# Altium schematic sheet 05_LMS7002M_Misc.SchDoc: LMS7002M misc
size A3; Organization: Lime Microsystems; Address1: Surrey Tech Centre; Address2: Guildford GU2 7YG; Address3: Surrey; Address4: United Kingdom; Revision: v2.2; SheetNumber: 5; SheetTotal: 10
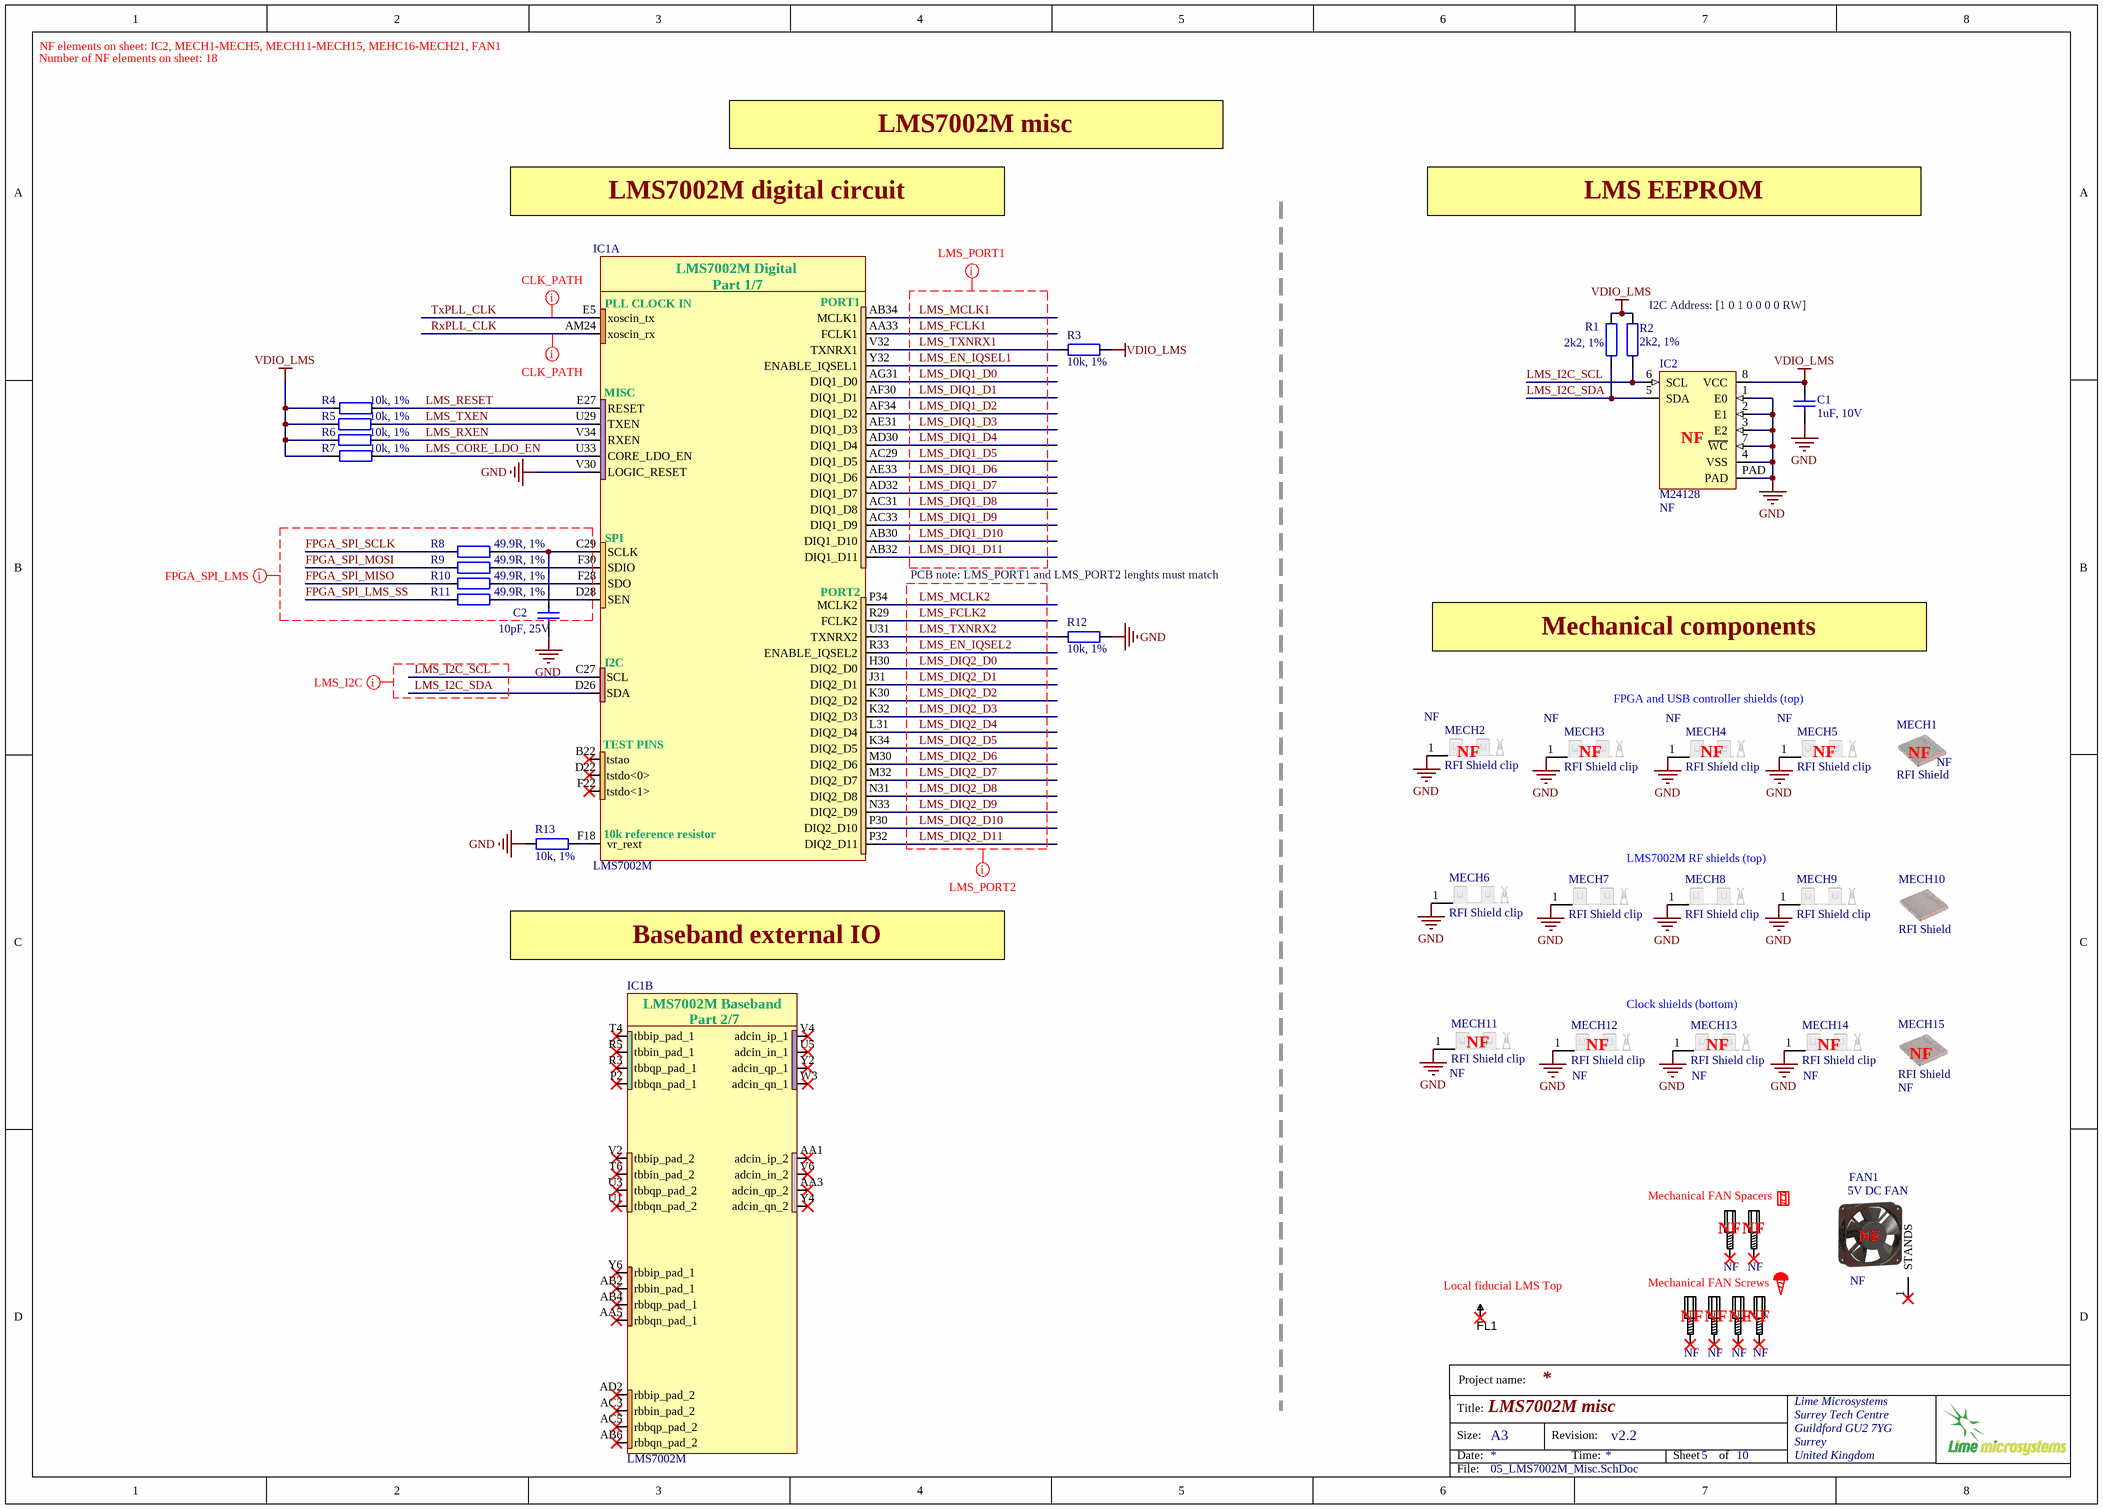
[diagram p0: 05_LMS7002M_Misc.SchDoc]

## Parts
C1  1uF, 10V  [CAP0402]
C2  10pF, 25V  [CAP0402]
FAN1  5V DC FAN  Assembly Info: NF  (mechanical)
FL1  Fiducial  [Fiducial_local]  (value not drawn)
IC1  LMS7002M  [LMS7002M_v5]  (parts A,B of 7)
IC2  M24128  Assembly Info: NF  [M24128-DFMC6TG]
MECH1  RFI Shield  Assembly Info: NF  [WurthElectronic_RF_shield]
MECH2  RFI Shield clip  Assembly Info: NF  [RFI_SHIELD_CLPS_MINI]
MECH3  RFI Shield clip  Assembly Info: NF  [RFI_SHIELD_CLPS_MINI]
MECH4  RFI Shield clip  Assembly Info: NF  [RFI_SHIELD_CLPS_MINI]
MECH5  RFI Shield clip  Assembly Info: NF  [RFI_SHIELD_CLPS_MINI]
MECH6  RFI Shield clip  [RFI_SHIELD_CLPS_MINI]
MECH7  RFI Shield clip  [RFI_SHIELD_CLPS_MINI]
MECH8  RFI Shield clip  [RFI_SHIELD_CLPS_MINI]
MECH9  RFI Shield clip  [RFI_SHIELD_CLPS_MINI]
MECH10  RFI Shield  [WurthElectronic_RF_shield]
MECH11  RFI Shield clip  Assembly Info: NF  [RFI_SHIELD_CLPS_MINI]
MECH12  RFI Shield clip  Assembly Info: NF  [RFI_SHIELD_CLPS_MINI]
MECH13  RFI Shield clip  Assembly Info: NF  [RFI_SHIELD_CLPS_MINI]
MECH14  RFI Shield clip  Assembly Info: NF  [RFI_SHIELD_CLPS_MINI]
MECH15  RFI Shield  Assembly Info: NF  [WurthElectronic_RF_shield]
MECH16  Assembly Info: NF  (hidden comment: Spacer M3)  (mechanical)
MECH17  Assembly Info: NF  (hidden comment: Spacer M3)  (mechanical)
MECH18  Assembly Info: NF  (hidden comment: Screws M3 v1)  (mechanical)
MECH19  Assembly Info: NF  (hidden comment: Screws M3 v1)  (mechanical)
MECH20  Assembly Info: NF  (hidden comment: Screws M3 v2)  (mechanical)
MECH21  Assembly Info: NF  (hidden comment: Screws M3 v2)  (mechanical)
R1  2k2, 1%  [RES0402]
R2  2k2, 1%  [RES0402]
R3  10k, 1%  [RES0402]
R4  10k, 1%  [RES0402]
R5  10k, 1%  [RES0402]
R6  10k, 1%  [RES0402]
R7  10k, 1%  [RES0402]
R8  49.9R, 1%  [RES0402]
R9  49.9R, 1%  [RES0402]
R10  49.9R, 1%  [RES0402]
R11  49.9R, 1%  [RES0402]
R12  10k, 1%  [RES0402]
R13  10k, 1%  [RES0402]

## Nets
GND: C1.2 C2.2 IC1.V30(LOGIC_RESET) IC2.1(E0) IC2.2(E1) IC2.3(E2) IC2.4(VSS) IC2.7(~{WC}) IC2.PAD MECH2.1(GND) MECH3.1(GND) MECH4.1(GND) MECH5.1(GND) MECH6.1(GND) MECH7.1(GND) MECH8.1(GND) MECH9.1(GND) MECH11.1(GND) MECH12.1(GND) MECH13.1(GND) MECH14.1(GND) R12.2 R13.2
VDIO_LMS: C1.1 IC2.8(VCC) R1.1 R2.1 R3.2 R4.2 R5.1 R6.1 R7.2
FPGA_SPI_LMS_SS: R11.2
FPGA_SPI_MISO: R10.2
FPGA_SPI_MOSI: R9.2
FPGA_SPI_SCLK: R8.2
LMS_CORE_LDO_EN: IC1.U33(CORE_LDO_EN) R7.1
LMS_DIQ1_D0: IC1.AG31(DIQ1_D0)
LMS_DIQ1_D1: IC1.AF30(DIQ1_D1)
LMS_DIQ1_D2: IC1.AF34(DIQ1_D2)
LMS_DIQ1_D3: IC1.AE31(DIQ1_D3)
LMS_DIQ1_D4: IC1.AD30(DIQ1_D4)
LMS_DIQ1_D5: IC1.AC29(DIQ1_D5)
LMS_DIQ1_D6: IC1.AE33(DIQ1_D6)
LMS_DIQ1_D7: IC1.AD32(DIQ1_D7)
LMS_DIQ1_D8: IC1.AC31(DIQ1_D8)
LMS_DIQ1_D9: IC1.AC33(DIQ1_D9)
LMS_DIQ1_D10: IC1.AB30(DIQ1_D10)
LMS_DIQ1_D11: IC1.AB32(DIQ1_D11)
LMS_DIQ2_D0: IC1.H30(DIQ2_D0)
LMS_DIQ2_D1: IC1.J31(DIQ2_D1)
LMS_DIQ2_D2: IC1.K30(DIQ2_D2)
LMS_DIQ2_D3: IC1.K32(DIQ2_D3)
LMS_DIQ2_D4: IC1.L31(DIQ2_D4)
LMS_DIQ2_D5: IC1.K34(DIQ2_D5)
LMS_DIQ2_D6: IC1.M30(DIQ2_D6)
LMS_DIQ2_D7: IC1.M32(DIQ2_D7)
LMS_DIQ2_D8: IC1.N31(DIQ2_D8)
LMS_DIQ2_D9: IC1.N33(DIQ2_D9)
LMS_DIQ2_D10: IC1.P30(DIQ2_D10)
LMS_DIQ2_D11: IC1.P32(DIQ2_D11)
LMS_EN_IQSEL1: IC1.Y32(ENABLE_IQSEL1)
LMS_EN_IQSEL2: IC1.R33(ENABLE_IQSEL2)
LMS_FCLK1: IC1.AA33(FCLK1)
LMS_FCLK2: IC1.R29(FCLK2)
LMS_I2C_SCL: IC1.C27(SCL) IC2.6(SCL) R2.2
LMS_I2C_SDA: IC1.D26(SDA) IC2.5(SDA) R1.2
LMS_MCLK1: IC1.AB34(MCLK1)
LMS_MCLK2: IC1.P34(MCLK2)
LMS_RESET: IC1.E27(RESET) R4.1
LMS_RXEN: IC1.V34(RXEN) R6.2
LMS_TXEN: IC1.U29(TXEN) R5.2
LMS_TXNRX1: IC1.V32(TXNRX1) R3.1
LMS_TXNRX2: IC1.U31(TXNRX2) R12.1
RxPLL_CLK: IC1.AM24(xoscin_rx)
TxPLL_CLK: IC1.E5(xoscin_tx)
NetC2_1: C2.1 IC1.C29(SCLK) R8.1
NetIC1_D28: IC1.D28(SEN) R11.1
NetIC1_F18: IC1.F18(vr_rext) R13.1
NetIC1_F28: IC1.F28(SDO) R10.1
NetIC1_F30: IC1.F30(SDIO) R9.1

Not connected (* = marked no-connect by the designer): FAN1 1(STANDS)*; FL1 1*; IC1 AA1(adcin_ip_2)* AA3(adcin_qp_2)* AA5(rbbqn_pad_1)* AB2(rbbin_pad_1)* AB4(rbbqp_pad_1)* AB6(rbbqn_pad_2)* AC3(rbbin_pad_2)* AC5(rbbqp_pad_2)* AD2(rbbip_pad_2)* B22(tstao)* D22(tstdo<0>)* F22(tstdo<1>)* P2(tbbqn_pad_1)* R3(tbbqp_pad_1)* R5(tbbin_pad_1)* T4(tbbip_pad_1)* T6(tbbin_pad_2)* U1(tbbqn_pad_2)* U3(tbbqp_pad_2)* U5(adcin_in_1)* V2(tbbip_pad_2)* V4(adcin_ip_1)* V6(adcin_in_2)* W3(adcin_qn_1)* Y2(adcin_qp_1)* Y4(adcin_qn_2)* Y6(rbbip_pad_1)*; MECH16 MH1*; MECH17 MH1*; MECH18 MH1*; MECH19 MH1*; MECH20 MH1*; MECH21 MH1*

## Layout directives
net class CLK_PATH: RxPLL_CLK, TxPLL_CLK
net class FPGA_SPI_LMS: FPGA_SPI_LMS_SS, FPGA_SPI_MISO, FPGA_SPI_MOSI, FPGA_SPI_SCLK
net class LMS_I2C: LMS_I2C_SCL, LMS_I2C_SDA
net class LMS_PORT1: LMS_DIQ1_D0, LMS_DIQ1_D1, LMS_DIQ1_D2, LMS_DIQ1_D3, LMS_DIQ1_D4, LMS_DIQ1_D5, LMS_DIQ1_D6, LMS_DIQ1_D7, LMS_DIQ1_D8, LMS_DIQ1_D9, LMS_DIQ1_D10, LMS_DIQ1_D11, LMS_EN_IQSEL1, LMS_FCLK1, LMS_MCLK1, LMS_TXNRX1
net class LMS_PORT2: LMS_DIQ2_D0, LMS_DIQ2_D1, LMS_DIQ2_D2, LMS_DIQ2_D3, LMS_DIQ2_D4, LMS_DIQ2_D5, LMS_DIQ2_D6, LMS_DIQ2_D7, LMS_DIQ2_D8, LMS_DIQ2_D9, LMS_DIQ2_D10, LMS_DIQ2_D11, LMS_EN_IQSEL2, LMS_FCLK2, LMS_MCLK2, LMS_TXNRX2

## Notes on the sheet
- Number of NF elements on sheet: 18
- NF elements on sheet: IC2, MECH1-MECH5, MECH11-MECH15, MEHC16-MECH21, FAN1
- LMS7002M misc
- LMS7002M digital circuit
- LMS EEPROM
- (near R2) I2C Address: [1 0 1 0 0 0 0 RW]
- (near IC2) NF
- PCB note: LMS_PORT1 and LMS_PORT2 lenghts must match
- Mechanical components
- FPGA and USB controller shields (top)
- (near MECH2) NF
- (near MECH3) NF
- (near MECH4) NF
- (near MECH5) NF
- (near MECH1) NF
- LMS7002M RF shields (top)
- Baseband external IO
- (near MECH11) NF
- (near MECH12) NF
- Clock shields (bottom)
- (near MECH13) NF
- (near MECH14) NF
- (near MECH15) NF
- Mechanical FAN Spacers
- NF
- (near FAN1) NF
- (near FL1) Local fiducial LMS Top
- Mechanical FAN Screws
- Project name:
- Title:
- Size:
- Date:
- A3
- Revision:
- Time:
- Sheet
- of
- File:
- (in symbol LMS7002Mr4, part A) LMS7002M Digital; Part 1/7; PORT1; PLL CLOCK IN; MISC; SPI; PORT2; I2C; TEST PINS; 10k reference resistor
- (in symbol LMS7002Mr4, part B) LMS7002M Baseband; Part 2/7

## Library data of the parts
C1 = Cap_0402: Manufacturer Part Number 1: C1005X5R1E105K050BC; Manufacturer: TDK; Part Description: 1µF ±10% 10V X5R Ceramic Capacitor -55°C ~ 85°C Surface Mount, MLCC 0402 (1005 Metric) 0.039" L x 0.020" W (1.00mm x 0.50mm); Voltage Rating: 10; Capacitance Tolerance: ± 10%; Product Range: TDK - C Series; Ceramic Capacitor Case: 0402 [1005 Metric]; Capacitance: 1; Dielectric Characteristic: X6; Value: 1uF, 10V; Supplier 1: Digi-Key; Supplier Part Number 1: 445-9066-1-ND; MSL: -; RoHS: YES
C2 = Cap_0402: Manufacturer Part Number 1: 04023A100JAT2A; Manufacturer: AVX; Part Description: 10pF ±5% 25V C0G, NP0 Ceramic Capacitor -55°C ~ 125°C Surface Mount, MLCC 0402 (1005 Metric) 0.039" L x 0.020" W (1.00mm x 0.50mm); Capacitance Tolerance: ± 5%; Voltage Rating: 25; Ceramic Capacitor Case: 0402 [1005 Metric]; Capacitor Case Style: 0402 [1005 Metric]<!--FANDB--><div class="features-and-benefits-container"></div>; Dielectric Characteristic: C0G / NP0; SVHC: No SVHC (16-Jun-2014); Capacitance: 10; Value: 10pF, 25V; Supplier 1: Farnell; Supplier Part Number 1: 2332478RL; Product Range: -; RoHS: YES; Operating Temperature Min: -55; Operating Temperature Max: 125; Capacitance Tolerance ±: ± 5%; MSL: MSL 1 - Unlimited; Packaging: Cut Tape
FAN1 = 12V_DC_FAN: Manufacturer: Sunon Fans; Manufacturer Part Number 1: MC30060V2-000U-A99; Part Description: FAN AXIAL 30X6.9MM 5VDC WIRE; Voltage - Rated: 5VDC; Air Flow: 3.7 CFM (0.104m³/min); Static Pressure: 0.090 in H2O (22.4 Pa); Bearing Type: Vapo-Bearing™; Fan Type: Tubeaxial; Noise: 24.0 dB(A); RPM: 7500 RPM; Approvals: CE, CUR, TUV, UL; Current Rating: 0.072A; Supplier 1: Digi-Key; Supplier Part Number 1: 259-1572-ND; RoHS: RoHS Compliant; Category: Fans, Thermal Management; Stock 1: 2786; Pricing 1: 1=9.43, 10=8.816, 25=7.996, 50=7.381, 100=6.4584, 250=6.0484, 500=5.63832, 1000=5.4333 (USD); Part Status: Active; Size / Dimension: Square - 30mm L x 30mm H; Width: 6.90mm; Features: Auto Restart; Termination: 2 Wire Leads; Ingress Protection: -; Operating Temperature: -; Weight: 0.013 lb (5.9g); Voltage Range: -; Material - Frame: -; Material - Blade: -; Lifetime @ Temp.: -; ComponentLink1URL: http://portal.sunon.com.tw/pls/portal/sunonap.sunon_html_d_pkg.open_file?input_file_name=7264646F632F3230313430312F3137363536332F28443033303230393330472D3030292D332E706466; ComponentLink1Description: http://portal.sunon.com.tw/pls/portal/sunonap.sunon_html_d_pkg.open_file?input_file_name=7264646F632F3230313430312F3137363536332F28443033303230393330472D3030292D332E706466
IC1 = LMS7002Mr4: Schematic symbol revision 4. Default footprint - 0.31mm pad; Manufacturer: Lime Microsystems; Part Description: IC FPRF Transceiver LMS7002M; 261 pin aQFN; Supplier 1: Lime Microsystems; Supplier Part Number 1: LMS7002M; Manufacturer Part Number 1: LMS7002M
IC2 = M24128-DFMC6TG: Manufacturer: STMicroelectronics; Part Description: EEPROM Memory IC 128Kb (16K x 8) I²C 1MHz 450ns 8-UFDFPN (2x3); Memory Type: Non-Volatile; Memory Format: EEPROM; Memory Size: 128Kb (16K x 8); Write Cycle Time - Word, Page: 5ms; Memory Interface: I²C; Voltage - Supply: 1.7 V ~ 5.5 V; Supplier 1: Digi-Key; Manufacturer Part Number 1: M24128-DFMC6TG; RoHS: RoHS Compliant; Category: Integrated Circuits (ICs); Stock 1: 5894; Pricing 1: 1=0.35, 10=0.348, 100=0.2854, 500=0.27748, 1000=0.27004 (USD); Packaging: Cut Tape (CT); Part Status: Active; Technology: EEPROM; Operating Temperature: -40°C ~ 85°C (TA); Mounting Type: Surface Mount; Package / Case: 8-UFDFN Exposed Pad; Supplier Device Package: 8-UFDFPN (2x3); ComponentLink1URL: http://www.st.com/content/ccc/resource/technical/document/datasheet/59/05/c9/5b/7b/41/48/b6/CD00259167.pdf/files/CD00259167.pdf/jcr:content/translations/en.CD00259167.pdf; ComponentLink1Description: http://www.st.com/content/ccc/resource/technical/document/datasheet/59/05/c9/5b/7b/41/48/b6/CD00259167.pdf/files/CD00259167.pdf/jcr:content/translations/en.CD00259167.pdf; Supplier Part Number 1: 497-15739-1-ND
MECH1 MECH10 MECH15 = RFI_SHIELD_1: Part Description: Enclosure, Shielding Cabinet Cover, Shielding Cabinet, 25 mm, 25 mm, 3 mm, Tin Plate; Manufacturer: WURTH ELEKTRONIK; Manufacturer Part Number 1: 36003250; Enclosure Material: Tin Plate; External Height - Metric: 25; External Height - Imperial: 0.98"; Enclosure Type: Shielding Cabinet; External Depth - Metric: 3; External Depth - Imperial: 0.12"; Supplier 1: Farnell; Supplier: Farnell; RoHS: YES; IP Rating: -; External Width - Imperial: 0.98"; NEMA Rating: -; External Width - Metric: 25; Supplier Part Number 1: 1909662
MECH2-MECH9 MECH11-MECH14 = RFI_SHIELD_CLIP: Manufacturer: HARWIN; Part Description: RFI SHIELD CLIP MINI TIN SMD; Manufacturer Part Number 1: S0971-46R; SVHC: No SVHC (15-Jun-2015); Supplier 1: Farnell; Supplier: Farnell; Length: 5.8; Clip Type: RFI Shield Clip; Clip Diameter: -; Product Range: -; Mounting Hole Dia: -; RoHS: YES; Supplier Part Number 1: 2361677
MECH16 MECH17 = STANDOFF_M-F_THREADED_M3x8x10mm_HEX_5mm dia: STANDOFF M/F MET 5MM HEX 10MM L; Manufacturer: BOSSARD; Manufacturer Part Number 1: TDYSFF-M3/5; Part Description: Screwed spacer sleeve; Int.thread: M3; 5mm; brass; Supplier 1: TME; Supplier Part Number 1: TDYSFF-M3/5
MECH18 MECH19 = STANDOFF_M-F_THREADED_M3x8x10mm_HEX_5mm dia: STANDOFF M/F MET 5MM HEX 10MM L; Manufacturer: KRAFTBERG; Manufacturer Part Number 1: M3X3/D7985; Part Description: Screw; M3x3; DIN:7985; Head: cheese head; Phillips; steel; zinc; PH1; Supplier 1: TME; Supplier Part Number 1: M3X3/D7985
MECH20 MECH21 = STANDOFF_M-F_THREADED_M3x8x10mm_HEX_5mm dia: STANDOFF M/F MET 5MM HEX 10MM L; Manufacturer: KRAFTBERG; Manufacturer Part Number 1: M3X8/D7985B; Part Description: Screw; M3x8; DIN:7985; Head: cheese head; Phillips; black finish; Supplier 1: TME; Supplier Part Number 1: M3X8/D7985B
R1 R2 = Res_0402: Manufacturer: Stackpole Electronics Inc; Manufacturer Part Number 1: RMCF0402FT2K20; Part Description: RES SMD 2.2K OHM 1% 1/16W 0402; Resistance (Ohms): 2.2k; Temperature Coefficient: ±100ppm/°C; Power (Watts): 0.063W, 1/16W; Value: 2k2, 1%; Supplier 1: Digi-Key; Supplier Part Number 1: RMCF0402FT2K20CT-ND; Supplier Device Package: 0402; Package / Case: 0402 (1005 Metric); Size / Dimension: 0.039" L x 0.020" W (1.00mm x 0.50mm); Operating Temperature: -55°C ~ 155°C; Composition: Thick Film; Category: Resistors; Features: -; Height: 0.016" (0.40mm); RoHS: RoHS Compliant; Number of Terminations: 2; Packaging: Cut Tape (CT); Tolerance: ±1%
R3-R7 R12 R13 = Res_0402: Manufacturer: Yageo; Manufacturer Part Number 1: RC0402FR-0710KL; Part Description: RES SMD 10K OHM 1% 1/16W 0402; Temperature Coefficient: ±100ppm/°C; Power (Watts): 0.063W, 1/16W; Value: 10k, 1%; Supplier 1: Digi-Key; Supplier Part Number 1: 311-10.0KLRTR-ND; Resistance (Ohms): 10k; Packaging: Tape & Reel (TR); RoHS: RoHS Compliant; Package / Case: 0402 (1005 Metric); Tolerance: ±1%; Operating Temperature: -55°C ~ 155°C; Size / Dimension: 0.039" L x 0.020" W (1.00mm x 0.50mm); Number of Terminations: 2; Category: Resistors; Height: 0.016" (0.40mm); Supplier Device Package: 0402; Features: Moisture Resistant; Composition: Thick Film
R8-R11 = Res_0402: Manufacturer: Samsung Electro-Mechanics America, Inc.; Manufacturer Part Number 1: RC1005F49R9CS; Part Description: RES SMD 49.9 OHM 1% 1/16W 0402; Temperature Coefficient: ±100ppm/°C; Resistance (Ohms): 49.9; Power (Watts): 0.063W, 1/16W; Number of Terminations: 2; Size / Dimension: 0.039" L x 0.020" W (1.00mm x 0.50mm); Supplier Device Package: 0402 (1005 Metric); RoHS: RoHS Compliant; Supplier Part Number 1: 1276-3469-6-ND; Features: -; Packaging: Digi-Reel®; Tolerance: ±1%; Height: 0.016" (0.40mm); Category: Resistors; Composition: Thick Film; Package / Case: 0402 (1005 Metric); Supplier 1: Digi-Key; Operating Temperature: -55°C ~ 155°C; Value: 49.9R, 1%